# Altium schematic sheet WiirdFlex Bottom Alignment.SchDoc
size A
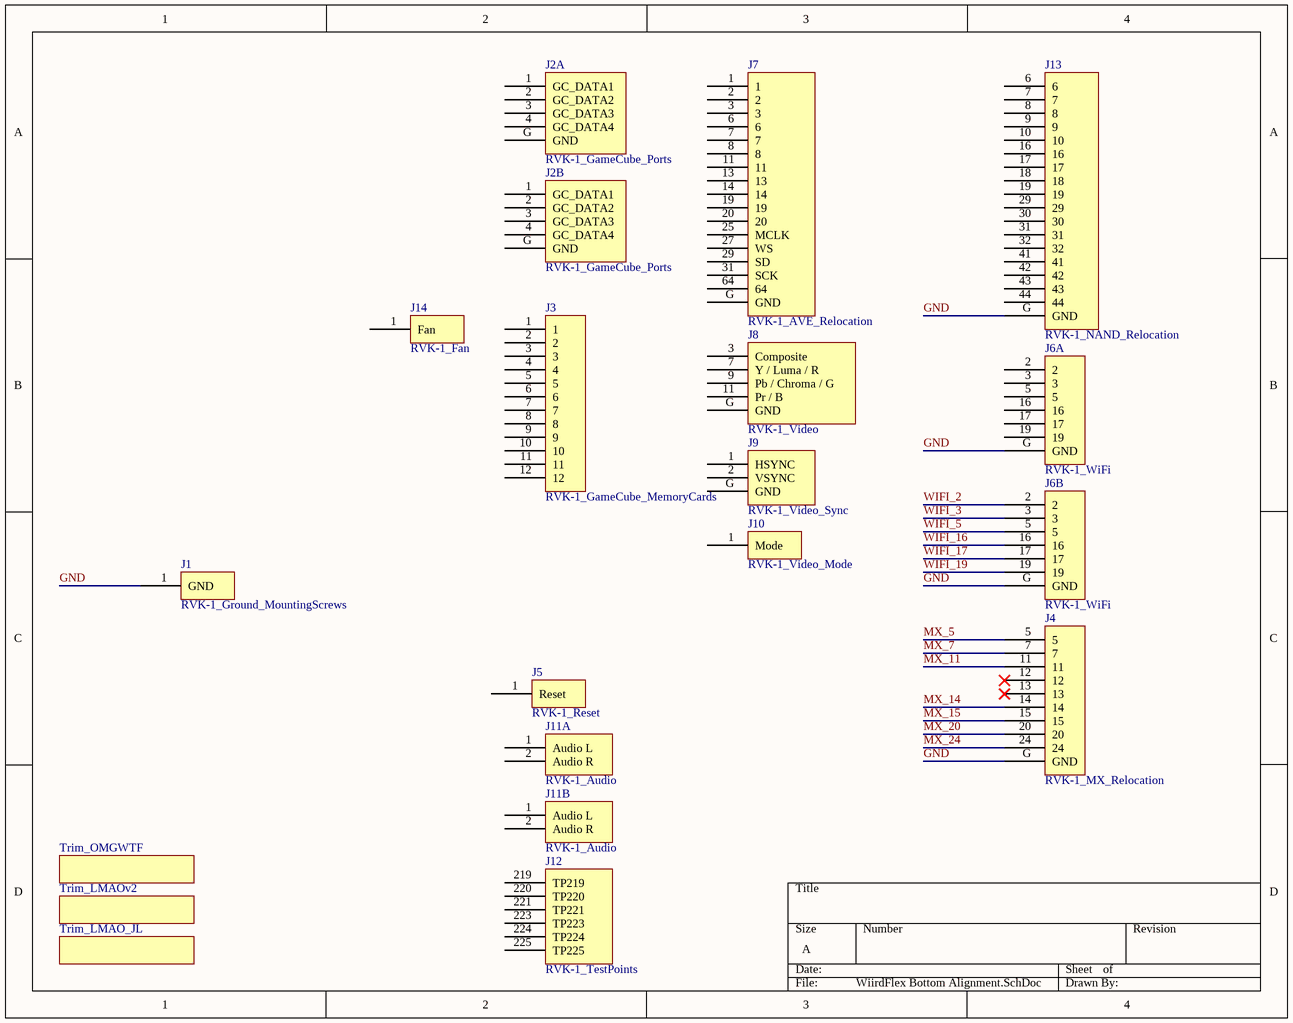
[diagram p0: WiirdFlex Bottom Alignment.SchDoc]

## Parts
J1  RVK-1_Ground_MountingScrews  [RVK-1_GND_Screws - bottom alignment board]
J2A  RVK-1_GameCube_Ports  [RVK-1_GC_Controller_RPads - alignment]
J2B  RVK-1_GameCube_Ports  [RVK-1_GC_Controller_Vias - alignment]
J3  RVK-1_GameCube_MemoryCards  [RVK-1_MemCard_TestPoints - alignment]
J4  RVK-1_MX_Relocation  [RVK-1_MX - alignment]
J5  RVK-1_Reset  [RVK-1_Reset - alignment]
J6A  RVK-1_WiFi  [RVK-1_WiFi_RPads - Alignment]
J6B  RVK-1_WiFi  [RVK-1_WiFi_Vias - Alignment]
J7  RVK-1_AVE_Relocation  [RVK-1_AVE_Vias - alignment]
J8  RVK-1_Video  [RVK-1_Video_Vias - alignment]
J9  RVK-1_Video_Sync  [RVK-1_Video_Sync - alignment]
J10  RVK-1_Video_Mode  [RVK-1_Video_Mode_via - alignment]
J11A  RVK-1_Audio  [RVK-1_AVE_Audio_Out - alignment]
J11B  RVK-1_Audio  [RVK-1_Audio_Preamp_Pads - alignment]
J12  RVK-1_TestPoints  [RVK-1_TestPoint_Vias - alignment]
J13  RVK-1_NAND_Relocation  [RVK-1_NAND_Vias - alignment]
J14  RVK-1_Fan  [RVK-1_Fan_PWM - alignment]
Trim_LMAO_JL  Misc  [Wii Trim: LMAO with extra mounting hole]  (value not drawn)
Trim_LMAOv2  Misc  [Wii trim: LMAOv2]  (value not drawn)
Trim_OMGWTF  Misc  [Wii trim: OMGWTF]  (value not drawn)

## Nets
GND: J1.1(GND) J4.G(GND) J6A.G(GND) J6B.G(GND) J13.G(GND)
MX_5: J4.5
MX_7: J4.7
MX_11: J4.11
MX_14: J4.14
MX_15: J4.15
MX_20: J4.20
MX_24: J4.24
WIFI_2: J6B.2
WIFI_3: J6B.3
WIFI_5: J6B.5
WIFI_16: J6B.16
WIFI_17: J6B.17
WIFI_19: J6B.19

Not connected (* = marked no-connect by the designer): J2A 1(GC_DATA1) 2(GC_DATA2) 3(GC_DATA3) 4(GC_DATA4) G(GND); J2B 1(GC_DATA1) 2(GC_DATA2) 3(GC_DATA3) 4(GC_DATA4) G(GND); J3 1 2 3 4 5 6 7 8 9 10 11 12; J4 12* 13*; J5 1(Reset); J6A 2 3 5 16 17 19; J7 1 2 3 6 7 8 11 13 14 19 20 25(MCLK) 27(WS) 29(SD) 31(SCK) 64 G(GND); J8 3(Composite) 7(Y_/_Luma_/_R) 9(Pb_/_Chroma_/_G) 11(Pr_/_B) G(GND); J9 1(HSYNC) 2(VSYNC) G(GND); J10 1(Mode); J11A 1(Audio_L) 2(Audio_R); J11B 1(Audio_L) 2(Audio_R); J12 219(TP219) 220(TP220) 221(TP221) 223(TP223) 224(TP224) 225(TP225); J13 6 7 8 9 10 16 17 18 19 29 30 31 32 41 42 43 44; J14 1(Fan)

## Library data of the parts
Trim_LMAO_JL Trim_LMAOv2 Trim_OMGWTF = Misc: placeholder for footprints without pads - keepouts, trim outlines, etc; ClassName: Keepout